# EAGLE design oled (EAGLE 9.6.2)
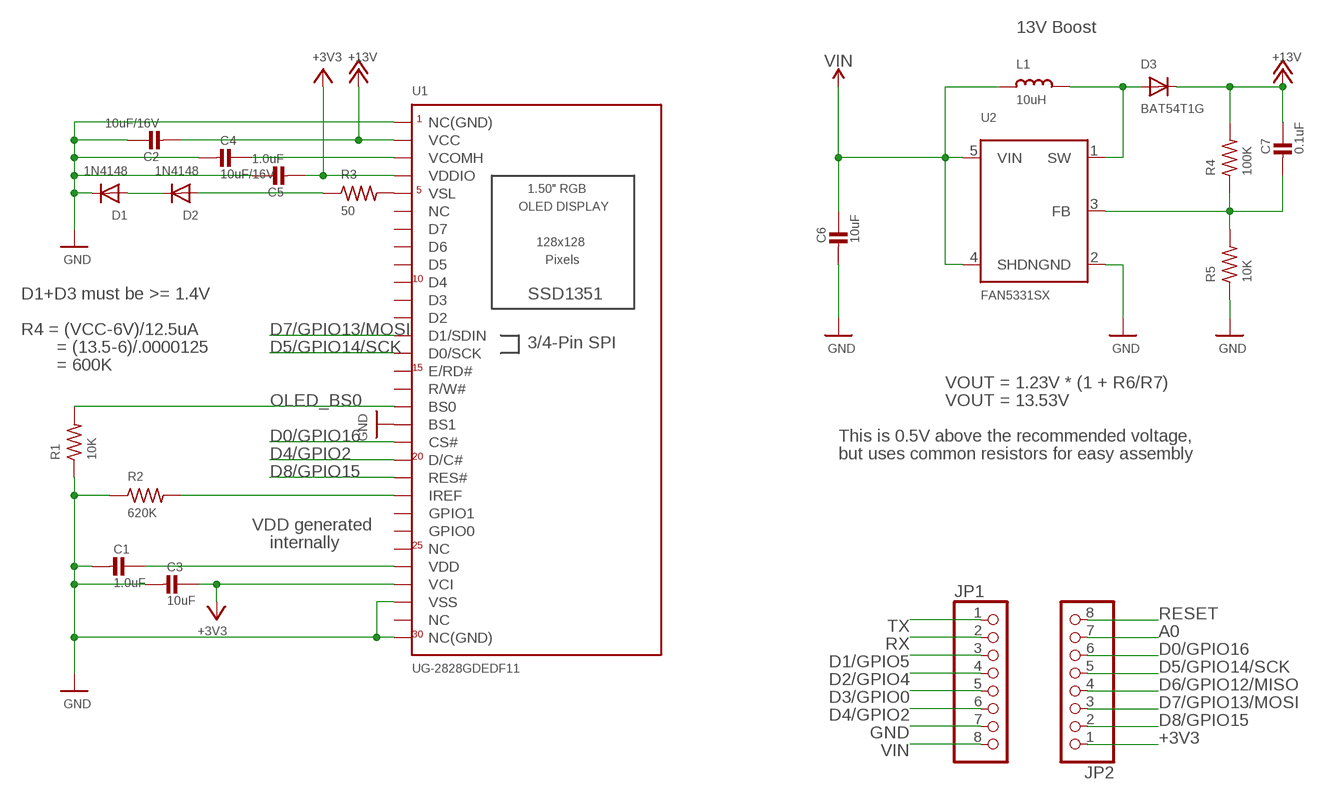
[diagram p0: schematic, sheet 1]

## Parts
C1  1.0uF  CAP_CERAMIC0805  [0805]
C2  10uF/16V  CAP_CERAMIC0805  [0805]
C3  10uF  CAP_CERAMIC0805  [0805]
C4  10uF/16V  CAP_CERAMIC0805  [0805]
C5  1.0uF  CAP_CERAMIC0805  [0805]
C6  10uF  CAP_CERAMIC0805  [0805]
C7  0.1uF  CAP_CERAMIC0805  [0805]
D1  1N4148  DIODESOD-323  [SOD-323]
D2  1N4148  DIODESOD-323  [SOD-323]
D3  BAT54T1G  DIODESOD-123  [SOD-123]
JP1  PINHD-1X8CLEANBIG  [1X08-CLEANBIG]
JP2  PINHD-1X8CLEANBIG  [1X08-CLEANBIG]
L1  10uH  INDUCTOR  [INDUCTOR_1007]
R1  10K  R-US_R0805  [R0805]
R2  620K  R-US_R0805  [R0805]
R3  50  R-US_R0805  [R0805]
R4  100K  R-US_R0805  [R0805]
R5  10K  R-US_R0805  [R0805]
U1  UG-2828GDEDF11  DISP_OLED_UG-2828GDEDF11TOP  [FPC_XF2M-3015-1A]
U2  FAN5331SX  FAN5331  [SOT23-5@1]

## Nets
13V [power]: C2.2 C7.1 D3.C R4.2 U1.P$29(VCC) ; supply symbol labelled +13V
+3V3 [power]: C3.1 C5.2 JP2.1 U1.P$4(VCI) U1.P$27(VDDIO)
A0: JP2.7
D0/GPIO16: JP2.6 U1.P$12(CS#)
D1/GPIO5: JP1.3
D2/GPIO4: JP1.4
D3/GPIO0: JP1.5
D4/GPIO2: JP1.6 U1.P$11(D/C#)
D5/GPIO14/SCK: JP2.5 U1.P$17(D0/SCK)
D6/GPIO12/MISO: JP2.4
D7/GPIO13/MOSI: JP2.3 U1.P$18(D1/SDIN)
D8/GPIO15: JP2.2 U1.P$10(RES#)
GND: C1.2 C2.1 C3.2 C4.2 C5.1 C6.2 D1.C JP1.7 R1.1 R2.1 R5.1 U1.P$1(NC(GND)) U1.P$3(VSS) U1.P$13(BS1) U1.P$30(NC(GND)) U2.2(GND)
IREF: R2.2 U1.P$9(IREF)
N$3: C1.1 U1.P$5(VDD)
N$5: D3.A L1.P$2 U2.1(SW)
N$6: R3.2 U1.P$26(VSL)
N$7: D2.A R3.1
N$8: C7.2 R4.1 R5.2 U2.3(FB)
N$11: D1.A D2.C
OLED_BS0: R1.2 U1.P$14(BS0)
RESET: JP2.8
RX: JP1.2
TX: JP1.1
VCOMH: C4.1 U1.P$28(VCOMH)
VIN [power]: C6.1 JP1.8 L1.P$1 U2.4(SHDN) U2.5(VIN)
Unconnected: U1.P$2(NC) U1.P$6(NC) U1.P$7(GPIO0) U1.P$8(GPIO1) U1.P$15(R/W#) U1.P$16(E/RD#) U1.P$19(D2) U1.P$20(D3) U1.P$21(D4) U1.P$22(D5) U1.P$23(D6) U1.P$24(D7) U1.P$25(NC)

## Notes on the sheet
- 13V Boost
- D1+D3 must be >= 1.4V
- R4 = (VCC-6V)/12.5uA
- = (13.5-6)/.0000125
- = 600K
- VOUT = 1.23V * (1 + R6/R7)
- VOUT = 13.53V
- This is 0.5V above the recommended voltage,
- but uses common resistors for easy assembly
- VDD generated
- internally

## Library data of the parts
C1 C5 = microbuilder:CAP_CERAMIC: Ceramic Capacitors For new designs, use the packages preceded by an '_' character since they are more reliable: The following footprints should be used on most boards: _0402 - Standard footprint for regular board layouts _0603 - Standard footprint for regular board layouts _0805 - Standard footprint for regular board layouts For extremely tight-pitch boards where space is at a premium, the following 'micro-pitch' footprints can be used (smaller pads, no silkscreen outline, etc.): _0402MP - Micro-pitch footprint for very dense/compact boards _0603MP - Micro-pitch footprint for very dense/compact boards _0805MP - Micro-pitch footprint for very dense/compact boards Commonly Stocked Parts 0402 - 0402 Surface Mount Capacitors 16pF 50V 5% [Digikey: 445-4899-2-ND] 18pF 50V 5% [Digikey: 490-1281-2-ND] 22pF 50V 5% [Digikey: 490-1283-2-ND] 68pF 50V 5% [Digikey: 490-1289-2-ND] 0.1uF 10V 10% [Digikey: 490-1318-2-ND] 1.0uF 6.3V 10% [Digikey: 490-1320-2-ND] 0603 - 0603 Surface Mount Capacitors 16 pF 50V 5% [Digikey: 445-5051-2-ND] 22 pF 50V [Digikey: PCC220ACVTR-ND] 33 pF 50V 5% [Digikey: 490-1415-1-ND] 56pF 50V 5% [Digikey: 490-1421-1-ND] 220pF 50V 5% [Digikey: 445-1285-1-ND] 680 pF 50V 2200 pF 50V 5% C0G [Digikey: 445-1297-1-ND] 5600 pF 100V 5% X7R [Digikey: 478-3711-1-ND] 0.1 µF 25V 10% [Digikey: PCC2277TR-ND] 0.22 µF 16V 10% X7R [Digikey: 445-1318-1-ND] 1.0 µF 25V 10% [Digikey: 445-5146-2-ND] 0603 - RF Specific 3pF 250V +/-0.1pF RF [Digikey: 712-1347-1-ND] 18 pF 250V 5% [Digikey: 478-3505-1-ND or 712-1322-1-ND] 56 pF 250V 5% C0G RF [Digikey: 490-4867-1-ND] 68 pF 250V RF [Digikey: 490-4868-1-ND] 0805 - 0805 Surface Mount Capacitors 220 pF 250V 2% RF Ceramic Capacitor [Digikey: 712-1398-1-ND] 1000 pF 50V 2% NP0 Ceramic Capacitor [Digikey: 478-3760-1-ND] 0.1 µF 25V 10% Ceramic Capacitor [Digikey: PCC1828TR-ND] 1.0 µF 16V 10% Ceramic Capacitor[Digikey: 490-1691-2-ND] 10.0 µF 10V 10% Ceramic Capacitor[Digikey: 709-1228-1-ND] 10.0 uF 16V 10% Ceramic Capacitor [Digikey: 478-5165-2-ND] 47 uF 6.3V 20% Ceramic Capacitor [Digikey: 587-1779-1-ND or 399-5506-1-ND] 1206 - 1206 Surface Mount Capacitors 47uF 10V 20% Ceramic Capacitor [Digikey: 490-5528-1-ND or 399-5508-1-ND or 445-6010-1-ND] 100uF 6.3V -20%, +80% Y5V Ceramic Capacitor (Digikey: 490-4512-1-ND, Mouser: 81-GRM31CF50J107ZE1L); MPN: C0805C105K4RAC7210
C2-C4 C6 = microbuilder:CAP_CERAMIC: Ceramic Capacitors For new designs, use the packages preceded by an '_' character since they are more reliable: The following footprints should be used on most boards: _0402 - Standard footprint for regular board layouts _0603 - Standard footprint for regular board layouts _0805 - Standard footprint for regular board layouts For extremely tight-pitch boards where space is at a premium, the following 'micro-pitch' footprints can be used (smaller pads, no silkscreen outline, etc.): _0402MP - Micro-pitch footprint for very dense/compact boards _0603MP - Micro-pitch footprint for very dense/compact boards _0805MP - Micro-pitch footprint for very dense/compact boards Commonly Stocked Parts 0402 - 0402 Surface Mount Capacitors 16pF 50V 5% [Digikey: 445-4899-2-ND] 18pF 50V 5% [Digikey: 490-1281-2-ND] 22pF 50V 5% [Digikey: 490-1283-2-ND] 68pF 50V 5% [Digikey: 490-1289-2-ND] 0.1uF 10V 10% [Digikey: 490-1318-2-ND] 1.0uF 6.3V 10% [Digikey: 490-1320-2-ND] 0603 - 0603 Surface Mount Capacitors 16 pF 50V 5% [Digikey: 445-5051-2-ND] 22 pF 50V [Digikey: PCC220ACVTR-ND] 33 pF 50V 5% [Digikey: 490-1415-1-ND] 56pF 50V 5% [Digikey: 490-1421-1-ND] 220pF 50V 5% [Digikey: 445-1285-1-ND] 680 pF 50V 2200 pF 50V 5% C0G [Digikey: 445-1297-1-ND] 5600 pF 100V 5% X7R [Digikey: 478-3711-1-ND] 0.1 µF 25V 10% [Digikey: PCC2277TR-ND] 0.22 µF 16V 10% X7R [Digikey: 445-1318-1-ND] 1.0 µF 25V 10% [Digikey: 445-5146-2-ND] 0603 - RF Specific 3pF 250V +/-0.1pF RF [Digikey: 712-1347-1-ND] 18 pF 250V 5% [Digikey: 478-3505-1-ND or 712-1322-1-ND] 56 pF 250V 5% C0G RF [Digikey: 490-4867-1-ND] 68 pF 250V RF [Digikey: 490-4868-1-ND] 0805 - 0805 Surface Mount Capacitors 220 pF 250V 2% RF Ceramic Capacitor [Digikey: 712-1398-1-ND] 1000 pF 50V 2% NP0 Ceramic Capacitor [Digikey: 478-3760-1-ND] 0.1 µF 25V 10% Ceramic Capacitor [Digikey: PCC1828TR-ND] 1.0 µF 16V 10% Ceramic Capacitor[Digikey: 490-1691-2-ND] 10.0 µF 10V 10% Ceramic Capacitor[Digikey: 709-1228-1-ND] 10.0 uF 16V 10% Ceramic Capacitor [Digikey: 478-5165-2-ND] 47 uF 6.3V 20% Ceramic Capacitor [Digikey: 587-1779-1-ND or 399-5506-1-ND] 1206 - 1206 Surface Mount Capacitors 47uF 10V 20% Ceramic Capacitor [Digikey: 490-5528-1-ND or 399-5508-1-ND or 445-6010-1-ND] 100uF 6.3V -20%, +80% Y5V Ceramic Capacitor (Digikey: 490-4512-1-ND, Mouser: 81-GRM31CF50J107ZE1L); MPN: CL21A106KOQNNNE
C7 = microbuilder:CAP_CERAMIC: Ceramic Capacitors For new designs, use the packages preceded by an '_' character since they are more reliable: The following footprints should be used on most boards: _0402 - Standard footprint for regular board layouts _0603 - Standard footprint for regular board layouts _0805 - Standard footprint for regular board layouts For extremely tight-pitch boards where space is at a premium, the following 'micro-pitch' footprints can be used (smaller pads, no silkscreen outline, etc.): _0402MP - Micro-pitch footprint for very dense/compact boards _0603MP - Micro-pitch footprint for very dense/compact boards _0805MP - Micro-pitch footprint for very dense/compact boards Commonly Stocked Parts 0402 - 0402 Surface Mount Capacitors 16pF 50V 5% [Digikey: 445-4899-2-ND] 18pF 50V 5% [Digikey: 490-1281-2-ND] 22pF 50V 5% [Digikey: 490-1283-2-ND] 68pF 50V 5% [Digikey: 490-1289-2-ND] 0.1uF 10V 10% [Digikey: 490-1318-2-ND] 1.0uF 6.3V 10% [Digikey: 490-1320-2-ND] 0603 - 0603 Surface Mount Capacitors 16 pF 50V 5% [Digikey: 445-5051-2-ND] 22 pF 50V [Digikey: PCC220ACVTR-ND] 33 pF 50V 5% [Digikey: 490-1415-1-ND] 56pF 50V 5% [Digikey: 490-1421-1-ND] 220pF 50V 5% [Digikey: 445-1285-1-ND] 680 pF 50V 2200 pF 50V 5% C0G [Digikey: 445-1297-1-ND] 5600 pF 100V 5% X7R [Digikey: 478-3711-1-ND] 0.1 µF 25V 10% [Digikey: PCC2277TR-ND] 0.22 µF 16V 10% X7R [Digikey: 445-1318-1-ND] 1.0 µF 25V 10% [Digikey: 445-5146-2-ND] 0603 - RF Specific 3pF 250V +/-0.1pF RF [Digikey: 712-1347-1-ND] 18 pF 250V 5% [Digikey: 478-3505-1-ND or 712-1322-1-ND] 56 pF 250V 5% C0G RF [Digikey: 490-4867-1-ND] 68 pF 250V RF [Digikey: 490-4868-1-ND] 0805 - 0805 Surface Mount Capacitors 220 pF 250V 2% RF Ceramic Capacitor [Digikey: 712-1398-1-ND] 1000 pF 50V 2% NP0 Ceramic Capacitor [Digikey: 478-3760-1-ND] 0.1 µF 25V 10% Ceramic Capacitor [Digikey: PCC1828TR-ND] 1.0 µF 16V 10% Ceramic Capacitor[Digikey: 490-1691-2-ND] 10.0 µF 10V 10% Ceramic Capacitor[Digikey: 709-1228-1-ND] 10.0 uF 16V 10% Ceramic Capacitor [Digikey: 478-5165-2-ND] 47 uF 6.3V 20% Ceramic Capacitor [Digikey: 587-1779-1-ND or 399-5506-1-ND] 1206 - 1206 Surface Mount Capacitors 47uF 10V 20% Ceramic Capacitor [Digikey: 490-5528-1-ND or 399-5508-1-ND or 445-6010-1-ND] 100uF 6.3V -20%, +80% Y5V Ceramic Capacitor (Digikey: 490-4512-1-ND, Mouser: 81-GRM31CF50J107ZE1L); MPN: C0805C104M3RACTU
D1 D2 = microbuilder:DIODE: Diode SMA Model Volts Amps Type Vf Vr Digikey # Notes SSA34-E3 40V 3A Schottky 480mV @ 3A 200uA @ 40V SSA34-E3/61TGITR-ND CDBA120-G 20V 1A Schottky 500mV @ 1A 500uA @ 20V 641-1014-6-ND REEL MBRA210 10V 2A Schottky 350mV @ 2A 700uA @ 10V MBRA210LT3 SOD-123 Model Volts Amps Type Vf Vr Order # Notes BAT54T1G 30V 200mA Schottky 800mV @ 200mA 2uA @ 25V BAT54T1GOSTR-ND B0530W 30V 500mA Schottky 430mV @ 500mA 130uA @ 30V B0530W-FDICT-ND REEL MBR120 20V 1A Schottky 340mV @ 1A MBR120VLSFT1GOSCT-ND SOD-323 Model Volts Amps Type Vf Vr Order # Notes PMEG2005EJ 20V 500mA Schottky 355mV @ 500mA 568-4110-1-ND ZLLS410 10V 570mA Schottky 380mV @ 570mA ZLLS410CT-ND 1N4148WS 75V 150mA Silicon/Simple 1V 1N4148WSFSCT-ND REEL SOD-523 Model Volts Amps Type Vf Vr Order # Notes BAT54XV2 30V 200mA Schottky 0.8V @ 100mA BAT54XV2CT-ND TB751S 30V 30mA Schottky RB751S-40TE61CT-ND SOT23-R/W (R = Solder Paste/Reflow Ovens, W = Hand-Soldering) Model Volts Amps Type Vf Vr Order # Notes BAT54FILM 40V 300mA Schottky 497-7162-1-ND; MPN: 1N4148WS-E3-08
D3 = microbuilder:DIODE: Diode SMA Model Volts Amps Type Vf Vr Digikey # Notes SSA34-E3 40V 3A Schottky 480mV @ 3A 200uA @ 40V SSA34-E3/61TGITR-ND CDBA120-G 20V 1A Schottky 500mV @ 1A 500uA @ 20V 641-1014-6-ND REEL MBRA210 10V 2A Schottky 350mV @ 2A 700uA @ 10V MBRA210LT3 SOD-123 Model Volts Amps Type Vf Vr Order # Notes BAT54T1G 30V 200mA Schottky 800mV @ 200mA 2uA @ 25V BAT54T1GOSTR-ND B0530W 30V 500mA Schottky 430mV @ 500mA 130uA @ 30V B0530W-FDICT-ND REEL MBR120 20V 1A Schottky 340mV @ 1A MBR120VLSFT1GOSCT-ND SOD-323 Model Volts Amps Type Vf Vr Order # Notes PMEG2005EJ 20V 500mA Schottky 355mV @ 500mA 568-4110-1-ND ZLLS410 10V 570mA Schottky 380mV @ 570mA ZLLS410CT-ND 1N4148WS 75V 150mA Silicon/Simple 1V 1N4148WSFSCT-ND REEL SOD-523 Model Volts Amps Type Vf Vr Order # Notes BAT54XV2 30V 200mA Schottky 0.8V @ 100mA BAT54XV2CT-ND TB751S 30V 30mA Schottky RB751S-40TE61CT-ND SOT23-R/W (R = Solder Paste/Reflow Ovens, W = Hand-Soldering) Model Volts Amps Type Vf Vr Order # Notes BAT54FILM 40V 300mA Schottky 497-7162-1-ND; MPN: BAT54T1G
JP1 JP2 = adafruit:PINHD-1X8: PIN HEADER; BOTTOM: 0; MPN: C124381; POPULATE: 1; THRU-HOLE: 1
L1 = microbuilder:INDUCTOR: Inductors 0603: 10nH Ceramic Inductor - microwire antenna/RF (Digikey: 712-1434-2-ND) 0805: 560nH Ceramic Inductor - RF (Digikey: 553-1047-1-ND) 270nH Ceramic Inductor - Q = 40@250MHz, +-5%, 1 Ohm DC Resistance (Digikey: 535-10506-2-ND) 1007 (2518 Metric) SMT: 10µH 10% 250mOhm 820mA 1007 Inductor (Digikey: 587-2189-1-ND) 22µH 10% 500mOhm 580mA 1007 Inductor (Digikey: 587-2190-1-ND) 47µH 10% 950mOhm 420mA 1007 Inductor (Digikey: 587-2191-1-ND) 47µH 5% 100mOhm 1A 1008 Inductor (Digikey: 732-1816-1-ND) 5.0x5.0mm (Taiyo Yuden NR5040 Series) 6.8µH 20% 2.3A 64mOhm Inductor (Digikey: 587-2374-2-ND) 5.0x5.0mm (TDK VLC5045 Series) 4.7µH 20% 3.3A 34mOhm Inductor (Digikey: 445-6526-1-ND) 6.8µH 20% 2.7A 46mOhm Inductor (Digikey: 445-6527-1-ND) 6.0x6.0mm (TDK VLC6045 Series) 4.7µH 20% 3.8A 27mOhm Inductor (Digikey: 445-6538-2-ND) 6.8µH 20% 3A 41mOhm Inductor (Digikey: 445-6540-1-ND) 6.2µH 30% 2.2A 45mOhm Inductor (Digikey: SRR5028-6R2YCT-ND) - Not TDK VLC6045 but footprint should match 6.0x6.0mm (TDK SLF6045 Series) 6.8uH 30% 2A 33mOhm Inductor (Digikey: 445-4572-1-ND, Mouser: 810-SLF645T6R8N2R0PF) 6.0x6.0mm (Sumida CDRH5D28 Series) 6.2uH 30% 1.8A 45mOhm Inductor (Digikey: 308-1542-1-ND) Taiyo Yuden NR3015T2R2M - 2.2uH 20% 1.5A (Digikey: 587-1648-2-ND, Mouser: 963-NR3015T2R2M) - Used with TI TPS62172 CoilCraft RFID Transponder Coil - MA5532-AE (For use with AS3935 Lightning Sensor); MPN: L0805R100MPWRT
R1 R5 = adafruit:R-US_: RESISTOR, American symbol; MPN: CRCW080510K0FKEAC
R2 = adafruit:R-US_: RESISTOR, American symbol; MPN: 0805W8F6203T5E
R3 = adafruit:R-US_: RESISTOR, American symbol; MPN: CRCW080550R0FKTA
R4 = adafruit:R-US_: RESISTOR, American symbol; MPN: CR0805AFX-1003EAS
U1 = microbuilder:DISP_OLED_UG-2828GDEDF11: 128x128 1.5" RGB OLED - UG-2828GDEDF11 30-Pin 0.5mm Pitch FPC Cable (Top+Bottom Contacts) - OMRON XF2M-3015-1A (Digikey: OR723TR-ND) This FPC connector has contacts on the top and bottom, but the appropriate pin needs to be selected depending on whether the OLED will be inserted right-side up (use the TOP pinout) or upside-down (use the BOTTOM pinout).; MPN: XF2M-3015-1A
U2 = microbuilder:FAN5331: FAN5331 - LED/OLED 20V Boost Converter Digikey: FAN5331SXCT-ND; MPN: FAN5331SX

## Net classes
1 power: width 0.406 mm

## Board
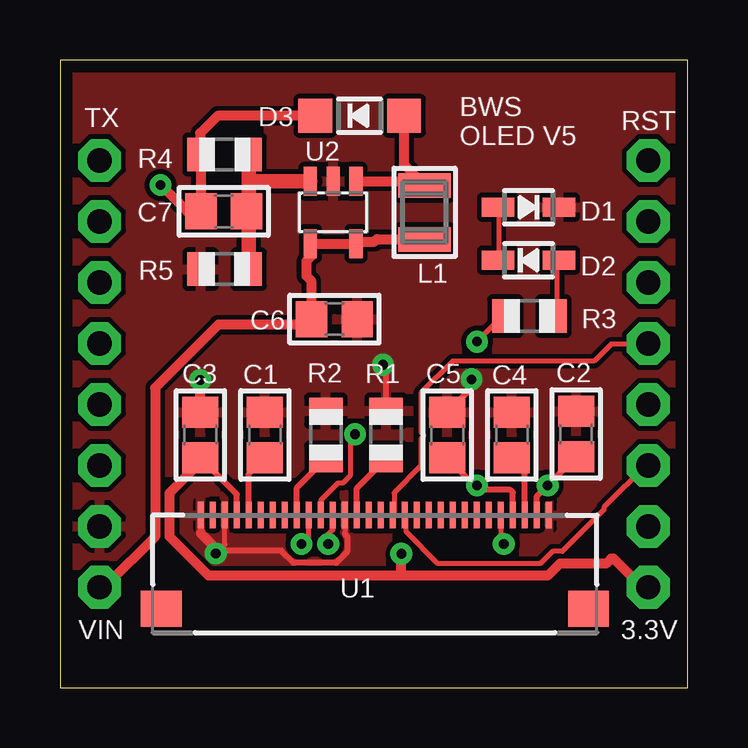
[diagram p1: board, top side]
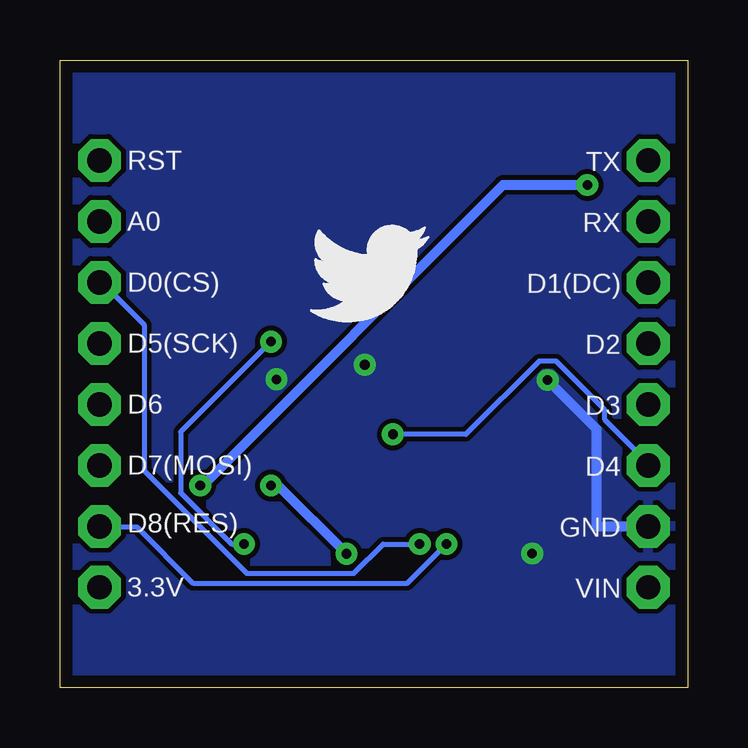
[diagram p2: board, bottom side, seen from below]

Size 26.16 x 26.16 mm. Coordinates in mm from the lower left corner, seen from the top.
Outline: 0,26.16 0,0 26.16,0 26.16,26.16 0,26.16
Copper layers (1*16): Top 0.035mm / dielectric 1.5mm / Bottom 0.035mm
Design rules "PCBCart-Standard *": minimum track width 8mil, minimum drill 0.4mm, track to track 8mil, track to pad 8mil, pad to pad 8mil, via to via 8mil, smd to smd 8mil, copper to edge 20mil, drill to drill 8mil, minimum pad ring 8mil, minimum via ring 10mil, stop-mask expansion 3mil, vias tented up to drill 20mil, thermal gap 8mil
bRestrict: area 45,46.8 to 45.2,47.3; area 46,47.6 to 46.5,47.8

### Footprints (pad centres in the part's own frame; a part is rotated, then mirrored left to right if it is on the bottom)
0805 = smd 1.3 x 1.5: 1 -0.95,0; 2 0.95,0
SOD-323 = smd 1.35 x 0.8: A 1.27,0; C -1.27,0
SOD-123 = smd 1.4 x 1.4: A 1.85,0; C -1.85,0
1X08-CLEANBIG = drill 1.016 pad 1.778 octagon: 1 -8.89,0; 2 -6.35,0; 3 -3.81,0; 4 -1.27,0; 5 1.27,0; 6 3.81,0; 7 6.35,0; 8 8.89,0
INDUCTOR_1007 = smd 1.016 x 2.2: P$1 -1.127,0; P$2 1.127,0
R0805 = smd 1.1 x 1.4: 1 -1,0; 2 1,0
FPC_XF2M-3015-1A = smd 0.25 x 1.1: P$1 7.25,-2.63; P$2 6.75,-2.63; P$3 6.25,-2.63; P$4 5.75,-2.63; P$5 5.25,-2.63; P$6 4.75,-2.63; P$7 4.25,-2.63; P$8 3.75,-2.63; P$9 3.25,-2.63; P$10 2.75,-2.63; P$11 2.25,-2.63; P$12 1.75,-2.63; P$13 1.25,-2.63; P$14 0.75,-2.63; P$15 0.25,-2.63; P$16 -0.25,-2.63; P$17 -0.75,-2.63; P$18 -1.25,-2.63; P$19 -1.75,-2.63; P$20 -2.25,-2.63; P$21 -2.75,-2.63; P$22 -3.25,-2.63; P$23 -3.75,-2.63; P$24 -4.25,-2.63; P$25 -4.75,-2.63; P$26 -5.25,-2.63; P$27 -5.75,-2.63; P$28 -6.25,-2.63; P$29 -6.75,-2.63; P$30 -7.25,-2.63 | smd 1.7 x 1.5: SUPPORT1 8.9,1.27; SUPPORT2 -8.9,1.27
SOT23-5@1 = smd 0.55 x 1.2: 1 -0.95,-1.3; 2 0,-1.3; 3 0.95,-1.3; 4 0.95,1.3; 5 -0.95,1.3

### Placement (x,y rotation side)
C1  8.54,10.54 90 top
C2  21.5,10.58 270 top
C3  5.84,10.54 90 top
C4  18.83,10.54 90 top
C5  16.13,10.54 270 top
C6  11.43,15.37 0 top
C7  6.82,19.85 0 top
D1  19.52,20.03 180 top
D2  19.52,17.82 0 top
D3  12.49,23.84 0 top
JP1  1.65,13.08 270 top
JP2  24.51,13.08 90 top
L1  15.19,19.81 90 top
R1  13.59,10.54 270 top
R2  11.08,10.54 270 top
R3  19.56,15.49 180 top
R4  6.86,22.23 180 top
R5  6.86,17.45 0 top
U1  13.12,4.57 180 top
U2  11.38,19.81 180 top
U$1  [TWITTER5MM]  15.75,15.24 0 bottom

### Tracks (layer width: path | path; a pad name or v marks a point on that pad's centre or on a via)
13V  (via drill 0.4)
  Top 0.254: U1.P$29 19.87,7.99 v20.31,8.44 C2.2
  Top 0.406: v20.32,8.43 v20.31,8.44 | D3.C 6.57,23.84 5.84,23.11 5.84,22.24 R4.2 5.86,19.86 C7.1 5.29,19.85 v4.19,20.95
  Bottom 0.406: v20.32,8.43 20.22,8.43 7.7,20.95 v4.19,20.95
+3V3  (via drill 0.4)
  Top 0.254: U1.P$4 7.37,8.07 C3.1 | C5.2 17.33,8.39 17.47,8.26 18.76,8.26 18.87,8.14 U1.P$27
  Top 0.406: 14.22,4.67 20.32,4.67 20.83,5.18 22.76,5.18 22.96,5.38 23.06,5.38 24.18,4.27 24.49,4.27 JP2.1 | 14.22,4.67 6.2,4.67 4.57,6.3 4.57,8.13 5.89,9.45 C3.1 | 14.22,4.67 v14.22,5.59 | v17.37,8.43 17.33,8.39
  Bottom 0.406: v17.37,8.43 17.07,8.43 v14.22,5.59
D0/GPIO16  (via drill 0.4)
  Top 0.203: v11.18,5.99 11.07,6.1 11.07,6.3 11.38,6.6 11.38,7.11 U1.P$12
  Bottom 0.203: v11.18,5.99 12.7,5.99 13.92,4.78 18.39,4.78 22.66,9.04 22.66,15.14 24.49,16.97 JP2.6
D4/GPIO2  (via drill 0.4)
  Top 0.203: v12.29,10.57 12.09,10.36 12.09,8.84 11.79,8.53 11.58,8.53 10.87,7.82 10.87,7.21 U1.P$11
  Bottom 0.203: v12.29,10.57 9.25,10.57 6.2,13.61 5.49,13.61 3.45,11.58 3.45,11.18 1.63,9.35 JP1.6
D5/GPIO14/SCK
  Top 0.203: U1.P$17 13.92,7.21 13.92,8.13 15.04,9.25 15.04,10.36 15.14,10.46 15.14,10.57 15.04,10.67 15.04,12.29 16.36,13.61 22.25,13.61 22.96,14.33 24.49,14.33 JP2.5
D7/GPIO13/MOSI
  Top 0.203: U1.P$18 14.43,7.11 14.43,6.5 15.75,5.18 20.02,5.18 20.52,5.69 20.93,5.69 22.66,7.42 22.66,7.52 24.49,9.35 JP2.3
D8/GPIO15  (via drill 0.4)
  Top 0.203: v10.06,5.99 10.36,6.3 10.36,7.11 U1.P$10
  Bottom 0.203: v10.06,5.99 11.68,4.37 20.62,4.37 22.96,6.71 24.49,6.71 JP2.2
GND  (via drill 0.4)
  Top 0.203: U1.P$13 11.89,7.11 11.89,6.6 11.87,6.45 | v6.49,5.6 6.87,5.98 U1.P$3
  Top 0.254: U1.P$1 5.87,6.45 | 11.87,6.45 11.87,6.41 11.96,6.32 11.96,5.67 11.5,5.21 9.73,5.21 9.23,5.71 6.6,5.71 | C5.1 17.27,12.63 17.27,13.08 17.14,12.95 v17.14,12.86 | R1.1 13.59,13.34 v13.46,13.46
  Top 0.406: 5.87,6.45 6.6,5.71 v6.49,5.6 | C3.2 v5.84,12.82 v5.84,12.83
  Bottom 0.406: v5.84,12.83 3.81,10.79 3.81,6.73 JP1.7
  pour Bottom (isolate 0.203): 26.16,26.16 0,26.16 0,0 26.16,0
  pour Top (isolate 0.203): 26.16,26.16 0,26.16 0,0 26.16,0
IREF
  Top 0.254: U1.P$9 9.87,8.33 R2.2
N$3
  Top 0.254: U1.P$5 7.87,8.92 C1.1
N$5
  Top 0.203: 15.14,21.03 14.63,21.03 14.99,20.97 L1.P$2 15.14,21.03
  Top 0.406: U2.1 14.85,21.11 14.99,20.97 | L1.P$2 14.34,21.79 D3.A
N$6  (via drill 0.4)
  Top 0.203: v18.49,5.99 18.39,6.1 18.39,7.11 U1.P$26 | v17.37,14.43 18.49,15.54 R3.2
  Bottom 0.203: v18.49,5.99 19,5.99 21.13,8.13 21.13,10.67 v17.37,14.43
N$7
  Top 0.203: D2.A 20.73,17.78 20.73,15.65 20.62,15.54 R3.1
N$8
  Top 0.61: R5.2 7.86,19.77 | 7.86,19.77 C7.2 | R4.1 7.86,21.08 | 7.86,21.08 7.86,19.77 | U2.3 7.89,21.11 7.86,21.08
N$11
  Top 0.203: D2.C 18.29,17.88 18.29,20.02 D1.A
OLED_BS0
  Top 0.254: U1.P$14 12.37,8.32 R1.2
VCOMH
  Top 0.254: U1.P$28 19.37,8.95 18.83,9.49
  Top 0.406: 18.83,9.49 C4.1
VIN
  Top 0.406: L1.P$1 15.14,18.69 13.21,18.69 13.11,18.59 12.5,18.59 U2.5 12.29,18.49 10.46,18.49 U2.4 10.46,18.29 10.46,17.98 10.26,17.78 10.26,17.17 10.46,16.97 10.46,15.44 C6.1 10.36,15.24 10.26,15.14 6.6,15.14 3.96,12.5 3.96,6.3 1.93,4.27 1.73,4.27 JP1.8

### Text on the board
tNames: TX | BWS / OLED V5 | RST | VIN | 3.3V
bNames: TX | RST | RX | A0 | D1(DC) | D0(CS) | D2 | D5(SCK) | D3 | D6 | D4 | D7(MOSI) | GND | D8(RES) | VIN | 3.3V